# EAGLE design Athena (EAGLE 5.06)
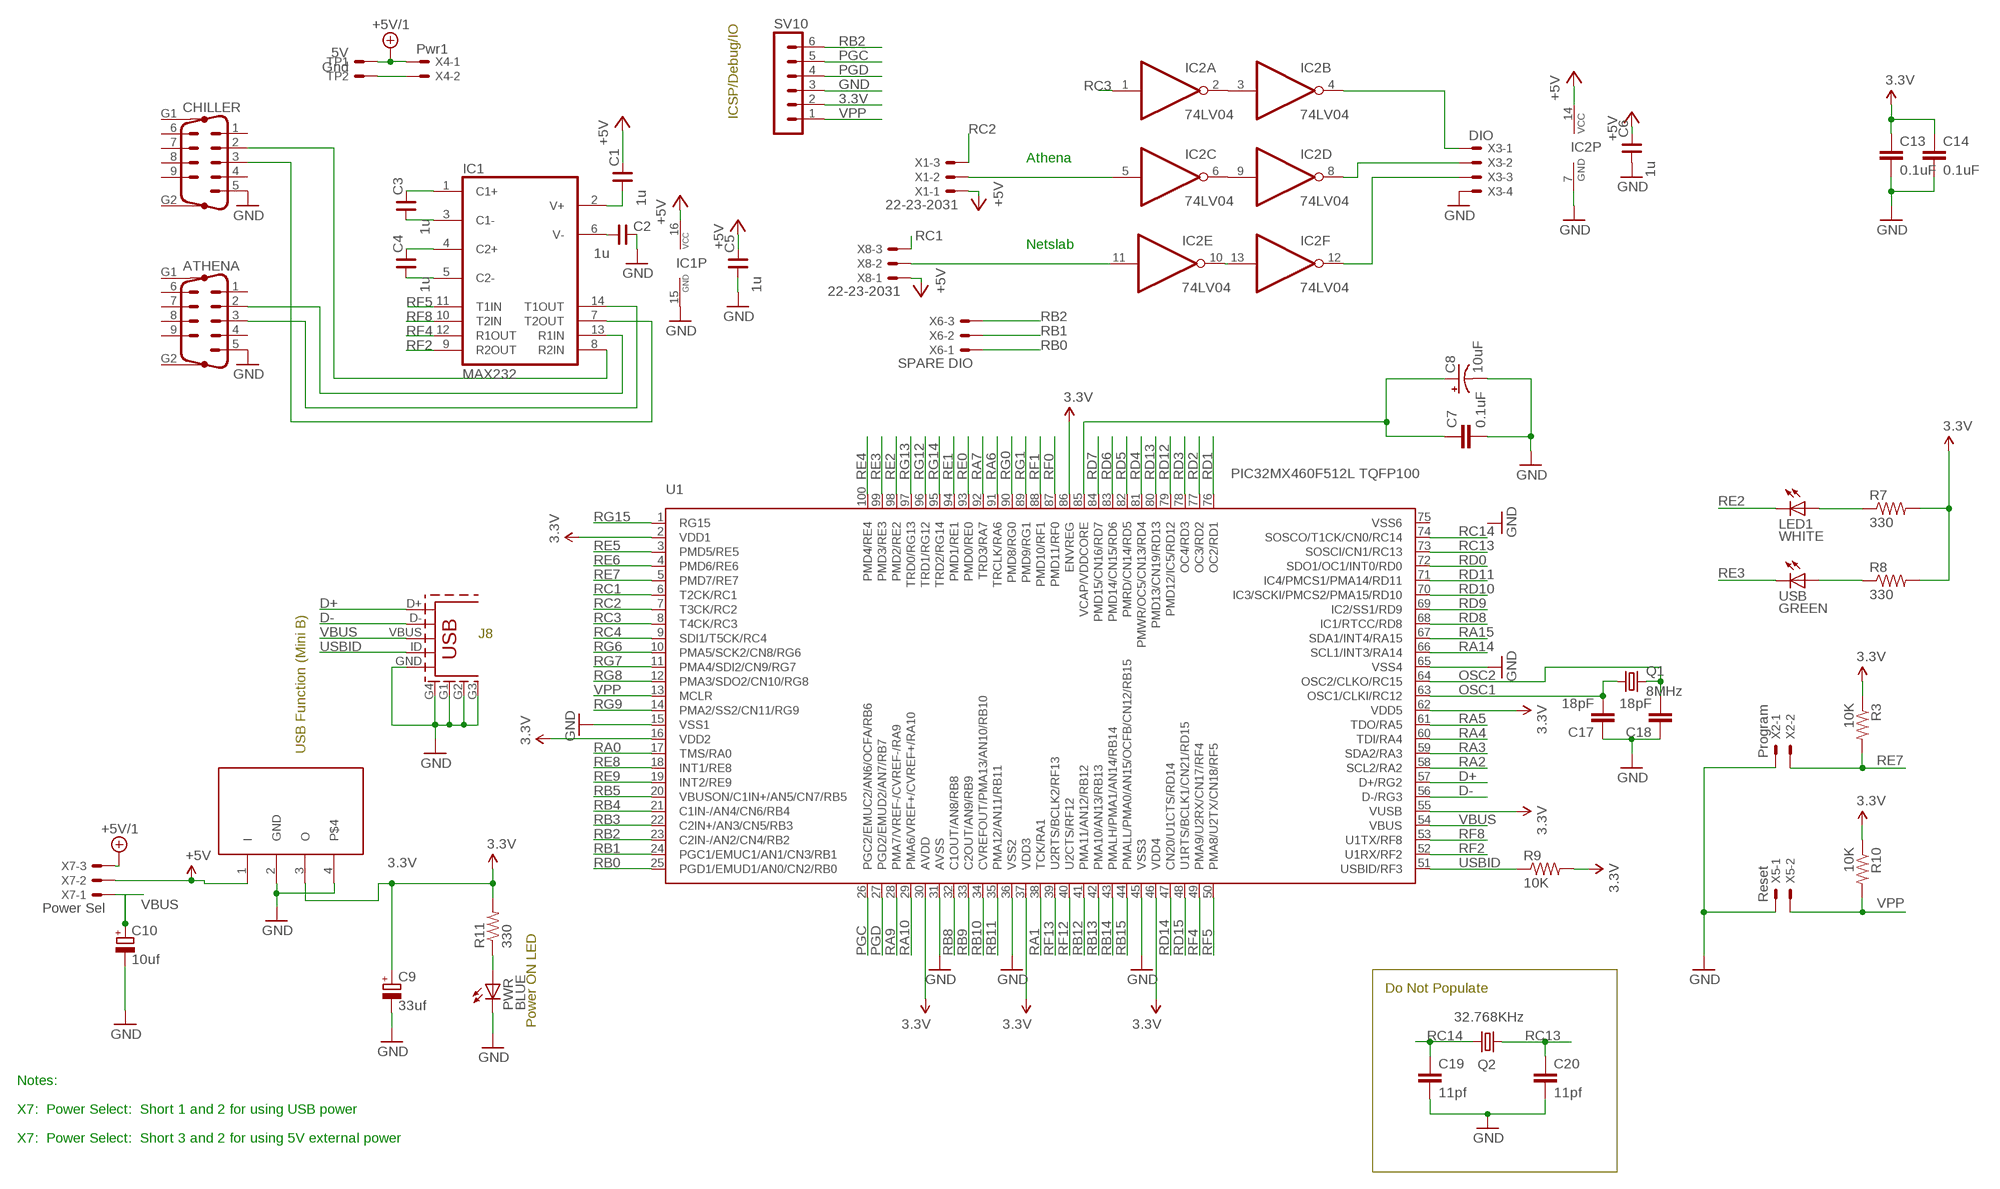
[diagram p0: schematic, sheet 1]

## Parts
ATHENA  M09HP  [M09HP]
C1  1u  CNP-C025-050X025  [C025-050X025]
C2  1u  CNP-C025-050X025  [C025-050X025]
C3  1u  CNP-C025-050X025  [C025-050X025]
C4  1u  CNP-C025-050X025  [C025-050X025]
C5  1u  CNP-C025-050X025  [C025-050X025]
C6  1u  CNP-C025-050X025  [C025-050X025]
C7  0.1uF  CAP0402-CAP  [0402-CAP]
C8  10uF  CAP_POL3528  [EIA3528]
C9  33uf  CPOL-EUE5-4  [E5-4]
C10  10uf  CPOL-EUE5-4  [E5-4]
C13  0.1uF  CAP0402  [C0402]
C14  0.1uF  CAP0402-CAP  [0402-CAP]
C17  18pF  CAP0402-CAP  [0402-CAP]
C18  18pF  CAP0402-CAP  [0402-CAP]
C19  11pf  CAP0402-CAP  [0402-CAP]
C20  11pf  CAP0402-CAP  [0402-CAP]
CHILLER  M09HP  [M09HP]
IC1  MAX232  [DIL16]
IC2  74LV04  74ACT04N  [DIL14]
LED1  WHITE  LED0603  [LED-0603]
PWR  BLUE  LED0603  [LED-0603]
Q1  8MHz  CRYSTAL5X3  [CRYSTAL-SMD-5X3]
Q2  32.768KHz  CRYSTAL32-SMD  [CRYSTAL-32KHZ-SMD]
R3  10K  RESISTOR0402-RES  [0402-RES]
R7  330  RESISTOR0402-RES  [0402-RES]
R8  330  RESISTOR0402-RES  [0402-RES]
R9  10K  RESISTOR0402-RES  [0402-RES]
R10  10K  RESISTOR0402-RES  [0402-RES]
R11  330  RESISTOR0402-RES  [0402-RES]
SV10  MA06-1  [MA06-1]
TP1  5V  TESTPOINT  [TESTPOINT]
TP2  Gnd  TESTPOINT  [TESTPOINT]
U1  PIC32MX460F512L TQFP100  PIC32MX4XXLTQFP100  [TQFP100]
U3  USB_5PINB  [USB-MINIB]
U$1  3.3VREG  [SOT223]
USB  GREEN  LED0603  [LED-0603]
X1  22-23-2031  [22-23-2031]
X2  Program  22-23-2021  [22-23-2021]
X3  DIO  22-23-2041  [22-23-2041]
X4  Pwr1  22-23-2021  [22-23-2021]
X5  Reset  22-23-2021  [22-23-2021]
X6  SPARE DIO  22-23-2031  [22-23-2031]
X7  Power Sel  22-23-2031  [22-23-2031]
X8  22-23-2031  [22-23-2031]

## Nets
3.3V: C9.+ C13.1 C14.1 R3.1 R7.2 R8.2 R9.2 R10.1 R11.2 SV10.2 U1.2(VDD1) U1.16(VDD2) U1.30(AVDD) U1.37(VDD3) U1.46(VDD4) U1.55(VUSB) U1.62(VDD5) U1.86(ENVREG) U$1.3(O)
+5V: C1.2 C5.2 C6.2 IC1.16(VCC) IC2.14(P:VCC) U$1.1(I) X1.1 X7.2 X8.1
+5V/1: TP1.TP(S) X4.1 X7.3
D+: U1.57(D+/RG2) U3.D+
D-: U1.56(D-/RG3) U3.D-
GND: ATHENA.5 C2.2 C5.1 C6.1 C7.2 C8.C(-) C9.- C10.- C13.2 C14.2 C17.1 C18.1 C19.2 C20.2 CHILLER.5 IC1.15(GND) IC2.7(P:GND) PWR.C SV10.3 TP2.TP(S) U1.15(VSS1) U1.31(AVSS) U1.36(VSS2) U1.45(VSS3) U1.65(VSS4) U3.G1 U3.G2 U3.G3 U3.G4(SHIELD) U3.GND U$1.2(GND) U$1.4 X2.1 X3.4 X4.2 X5.1
N$1: C2.1 IC1.6(V-)
N$2: C1.1 IC1.2(V+)
N$3: IC2.2(A:O) IC2.3(B:I)
N$4: IC2.6(C:O) IC2.9(D:I)
N$5: IC2.10(E:O) IC2.13(F:I)
N$6: C3.2 IC1.1(C1+)
N$7: C3.1 IC1.3(C1-)
N$8: C4.2 IC1.4(C2+)
N$9: C4.1 IC1.5(C2-)
N$10: CHILLER.2 IC1.8(R2IN)
N$11: CHILLER.3 IC1.7(T2OUT)
N$12: ATHENA.2 IC1.13(R1IN)
N$13: ATHENA.3 IC1.14(T1OUT)
N$15: IC2.11(E:I) X8.2
N$19: IC2.5(C:I) X1.2
N$21: IC2.4(B:O) X3.1
N$22: IC2.8(D:O) X3.2
N$23: IC2.12(F:O) X3.3
N$25: R8.1 USB.A
N$26: LED1.A R7.1
N$28: PWR.A R11.1
N$110: C7.1 C8.A(+) U1.85(VCAP/VDDCORE)
OSC1: C17.2 Q1.1 U1.63(OSC1/CLKI/RC12)
OSC2: C18.2 Q1.3 U1.64(OSC2/CLKO/RC15)
PGC: SV10.5 U1.26(PGC2/EMUC2/AN6/OCFA/RB6)
PGD: SV10.4 U1.27(PGD2/EMUD2/AN7/RB7)
RA0: U1.17(TMS/RA0)
RA1: U1.38(TCK/RA1)
RA2: U1.58(SCL2/RA2)
RA3: U1.59(SDA2/RA3)
RA4: U1.60(TDI/RA4)
RA5: U1.61(TDO/RA5)
RA6: U1.91(TRCLK/RA6)
RA7: U1.92(TRD3/RA7)
RA9: U1.28(PMA7/VREF-/CVREF-/RA9)
RA10: U1.29(PMA6/VREF+/CVREF+/RA10)
RA14: U1.66(SCL1/INT3/RA14)
RA15: U1.67(SDA1/INT4/RA15)
RB0: U1.25(PGD1/EMUD1/AN0/CN2/RB0) X6.1
RB1: U1.24(PGC1/EMUC1/AN1/CN3/RB1) X6.2
RB2: SV10.6 U1.23(C2IN-/AN2/CN4/RB2) X6.3
RB3: U1.22(C2IN+/AN3/CN5/RB3)
RB4: U1.21(C1IN-/AN4/CN6/RB4)
RB5: U1.20(VBUSON/C1IN+/AN5/CN7/RB5)
RB8: U1.32(C1OUT/AN8/RB8)
RB9: U1.33(C2OUT/AN9/RB9)
RB10: U1.34(CVREFOUT/PMA13/AN10/RB10)
RB11: U1.35(PMA12/AN11/RB11)
RB12: U1.41(PMA11/AN12/RB12)
RB13: U1.42(PMA10/AN13/RB13)
RB14: U1.43(PMALH/PMA1/AN14/RB14)
RB15: U1.44(PMALL/PMA0/AN15/OCFB/CN12/RB15)
RC1: U1.6(T2CK/RC1) X8.3
RC2: U1.7(T3CK/RC2) X1.3
RC3: IC2.1(A:I) U1.8(T4CK/RC3)
RC4: U1.9(SDI1/T5CK/RC4)
RC13: C20.1 Q2.X1 U1.73(SOSCI/CN1/RC13)
RC14: C19.1 Q2.X2 U1.74(SOSCO/T1CK/CN0/RC14)
RD0: U1.72(SDO1/OC1/INT0/RD0)
RD1: U1.76(OC2/RD1)
RD2: U1.77(OC3/RD2)
RD3: U1.78(OC4/RD3)
RD4: U1.81(PMWR/OC5/CN13/RD4)
RD5: U1.82(PMRD/CN14/RD5)
RD6: U1.83(PMD14/CN15/RD6)
RD7: U1.84(PMD15/CN16/RD7)
RD8: U1.68(IC1/RTCC/RD8)
RD9: U1.69(IC2/SS1/RD9)
RD10: U1.70(IC3/SCKI/PMCS2/PMA15/RD10)
RD11: U1.71(IC4/PMCS1/PMA14/RD11)
RD12: U1.79(PMD12/IC5/RD12)
RD13: U1.80(PMD13/CN19/RD13)
RD14: U1.47(CN20/U1CTS/RD14)
RD15: U1.48(U1RTS/BCLK1/CN21/RD15)
RE0: U1.93(PMD0/RE0)
RE1: U1.94(PMD1/RE1)
RE2: LED1.C U1.98(PMD2/RE2)
RE3: U1.99(PMD3/RE3) USB.C
RE4: U1.100(PMD4/RE4)
RE5: U1.3(PMD5/RE5)
RE6: U1.4(PMD6/RE6)
RE7: R3.2 U1.5(PMD7/RE7) X2.2
RE8: U1.18(INT1/RE8)
RE9: U1.19(INT2/RE9)
RF0: U1.87(PMD11/RF0)
RF1: U1.88(PMD10/RF1)
RF2: IC1.9(R2OUT) U1.52(U1RX/RF2)
RF4: IC1.12(R1OUT) U1.49(PMA9/U2RX/CN17/RF4)
RF5: IC1.11(T1IN) U1.50(PMA8/U2TX/CN18/RF5)
RF8: IC1.10(T2IN) U1.53(U1TX/RF8)
RF12: U1.40(U2CTS/RF12)
RF13: U1.39(U2RTS/BCLK2/RF13)
RG0: U1.90(PMD8/RG0)
RG1: U1.89(PMD9/RG1)
RG6: U1.10(PMA5/SCK2/CN8/RG6)
RG7: U1.11(PMA4/SDI2/CN9/RG7)
RG8: U1.12(PMA3/SDO2/CN10/RG8)
RG9: U1.14(PMA2/SS2/CN11/RG9)
RG12: U1.96(TRD1/RG12)
RG13: U1.97(TRD0/RG13)
RG14: U1.95(TRD2/RG14)
RG15: U1.1(RG15)
USBID: R9.1 U1.51(USBID/RF3) U3.ID(USB_ID)
VBUS: C10.+ U1.54(VBUS) U3.VBUS X7.1
VPP: R10.2 SV10.1 U1.13(MCLR) X5.2
Unconnected: ATHENA.1 ATHENA.4 ATHENA.6 ATHENA.7 ATHENA.8 ATHENA.9 ATHENA.G1 ATHENA.G2 CHILLER.1 CHILLER.4 CHILLER.6 CHILLER.7 CHILLER.8 CHILLER.9 CHILLER.G1 CHILLER.G2 U1.75(VSS6)

## Notes on the sheet
- ICSP/Debug/IO
- Athena
- Netslab
- J8
- USB Function (Mini B)
- Do Not Populate
- Power ON LED
- Notes:
- X7:  Power Select:  Short 1 and 2 for using USB power
- X7:  Power Select:  Short 3 and 2 for using 5V external power

## Library data of the parts
ATHENA CHILLER = con-subd:M09HP: SUB-D
C1-C6 = cap-master:CNP-: NON-POLARIZED CAP
C7 C14 C17-C20 = SparkFun:CAP: Capacitor Standard 0603 ceramic capacitor, and 0.1" leaded capacitor.
C8 = SparkFun02-20-08:CAP_POL: Capacitor Polarized These are standard SMD and PTH capacitors. Normally 10uF, 47uF, and 100uF in electrolytic and tantalum varieties. Always verify the external diameter of the through hole cap, it varies with capacity, voltage, and manufacturer. The EIA devices should be standard.
C9 C10 = resistor:CPOL-EU: POLARIZED CAPACITOR, European symbol
C13 = SparkFun02-20-08:CAP: Capacitor Standard 0603 ceramic capacitor, and 0.1" leaded capacitor.
IC1 = maxim:MAX232: RS232 TRANSEIVER
IC2 = 74xx-eu:74*04: Hex INVERTER
LED1 PWR USB = SparkFun:LED: LEDs Standard schematic elements and footprints for 5mm, 3mm, 1206, and 0603 sized LEDs. 5mm - Spark Fun Electronics SKU : COM-00529 (and others)
Q1 = SparkFun11_03_09:CRYSTAL: Crystals Various standard crystals. Proven footprints. Spark Fun Electronics SKU : COM-00534
Q2 = SchmalzHaus:CRYSTAL: Crystals Various standard crystals. Proven footprints. Spark Fun Electronics SKU : COM-00534
R3 R7-R11 = SparkFun:RESISTOR: Resistor Basic schematic elements and footprints for 0603, 1206, and PTH 1/10th watt (small) resistors.
SV10 = con-lstb:MA06-1: PIN HEADER
TP1 TP2 = OMX-MIX:TESTPOINT
U1 = SchmalzHaus:PIC32MX4XXL
U3 = OMX-MIX:USB_5PIN
U$1 = SparkFun:3.3VREG
X1 X6-X8 = con-molex:22-23-2031: .100" (2.54mm) Center Header - 3 Pin
X2 X4 X5 = con-molex:22-23-2021: .100" (2.54mm) Center Header - 2 Pin
X3 = con-molex:22-23-2041: .100" (2.54mm) Center Header - 4 Pin

## Board
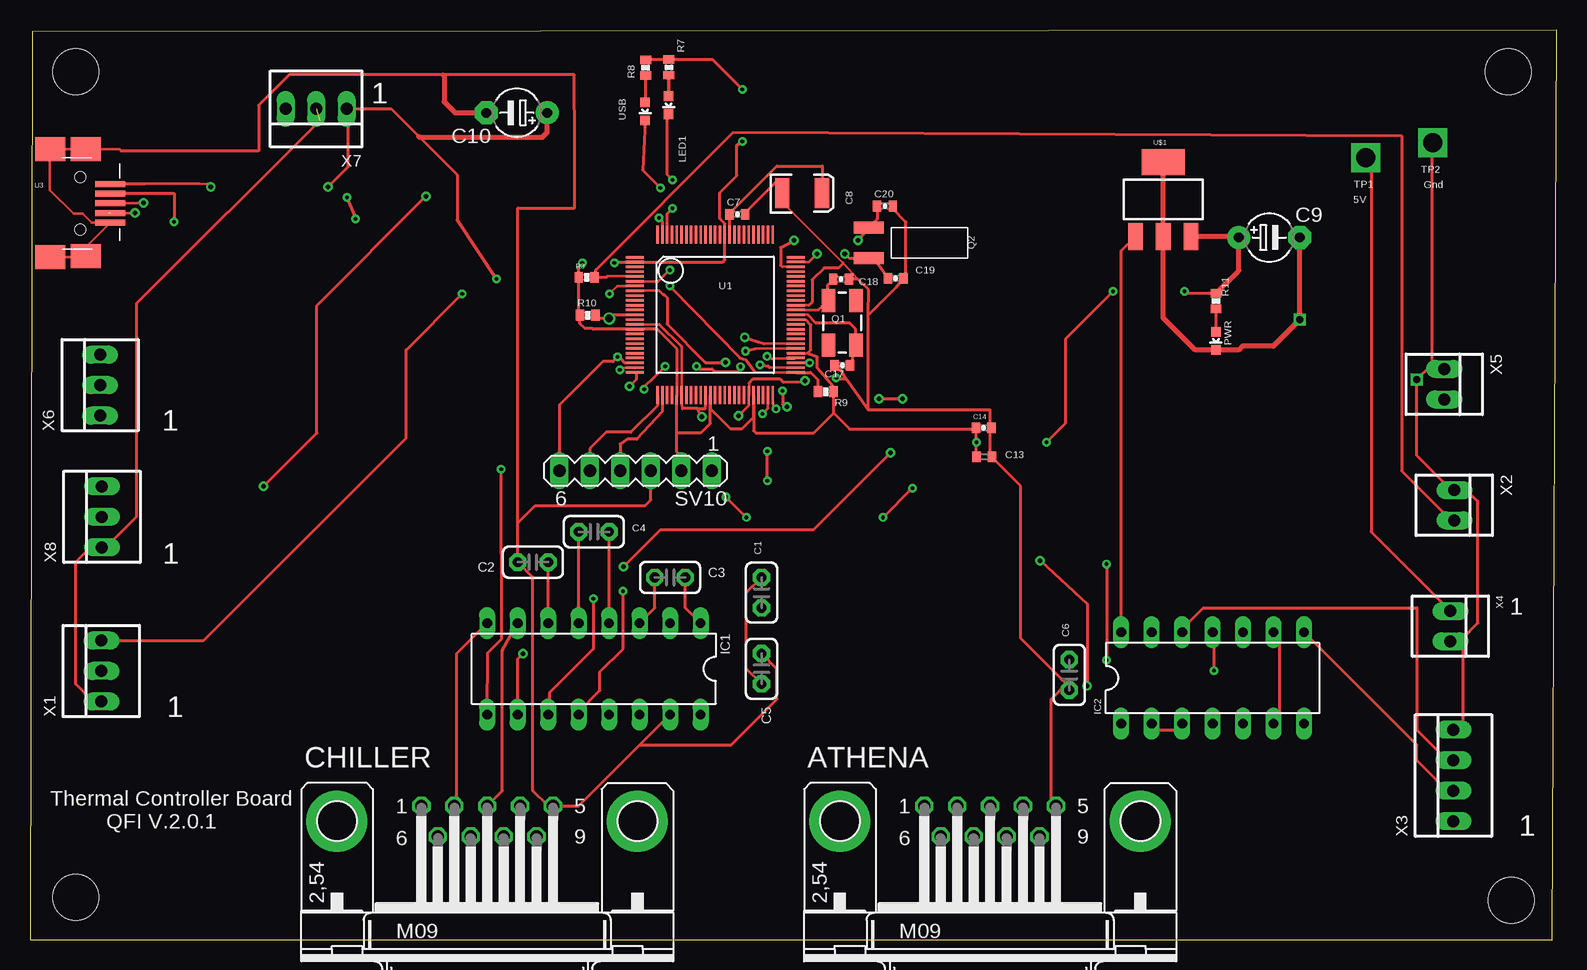
[diagram p1: board, top side]
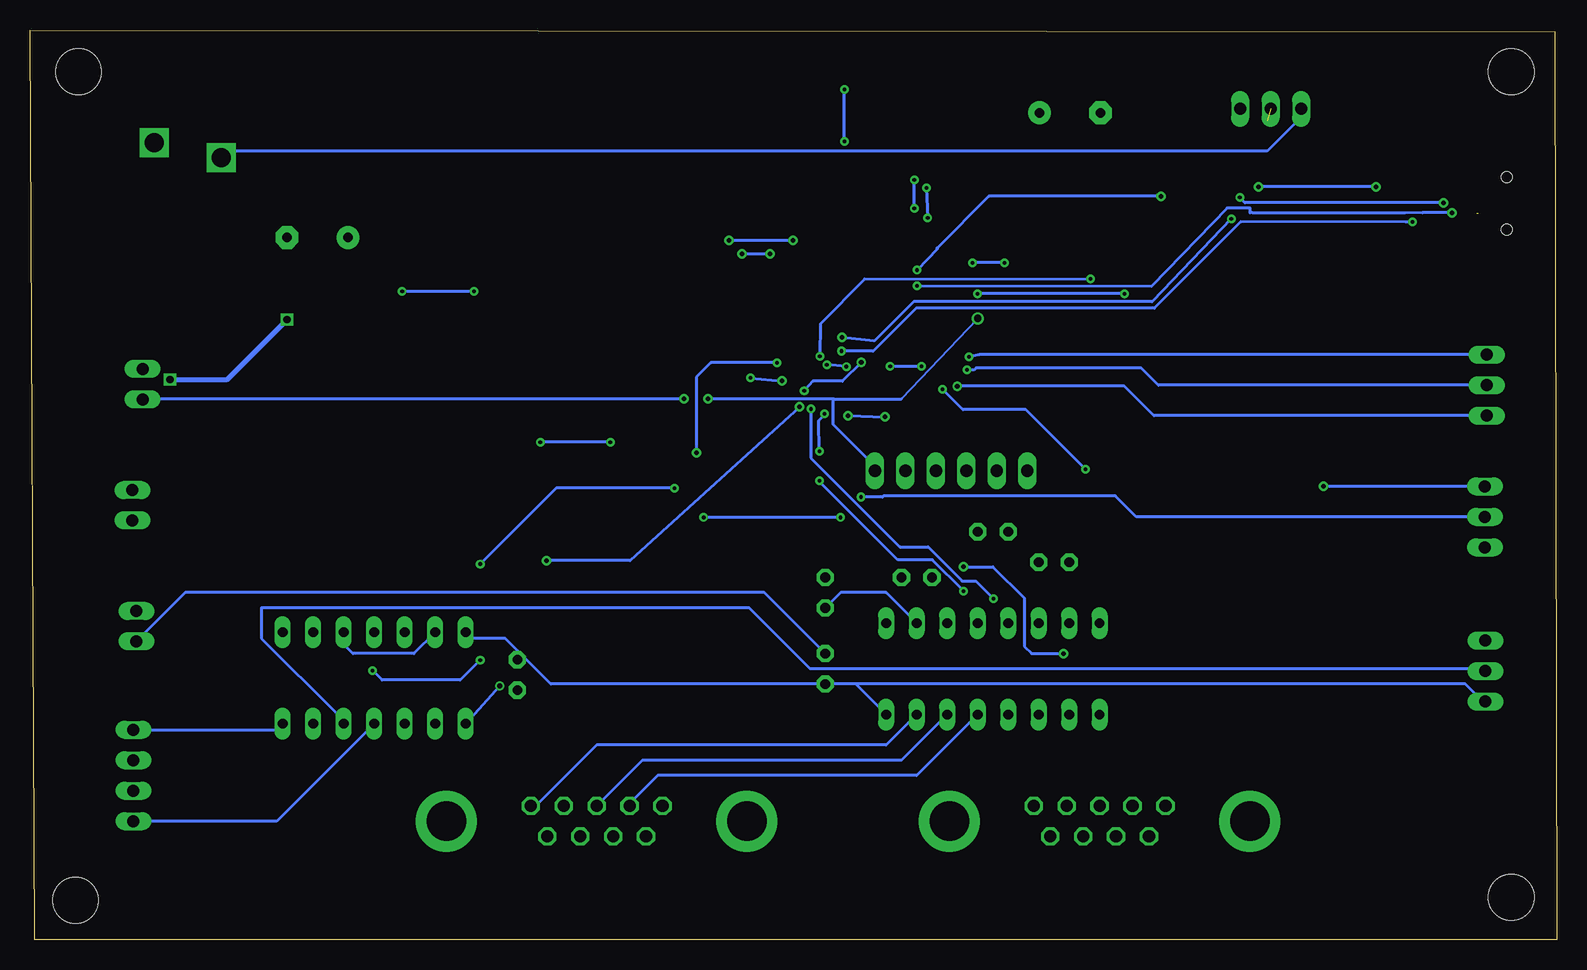
[diagram p2: board, bottom side, seen from below]

Size 127.23 x 75.87 mm. Coordinates in mm from the lower left corner, seen from the top.
Outline: 0,0 126.85,0 127.23,75.87 0.18,75.72 0,0
Copper layers (1*16): Top 0.035mm / dielectric 1.5mm / Bottom 0.035mm
Design rules "default *": minimum track width 5mil, minimum drill 10mil, track to track 5mil, track to pad 5mil, pad to pad 5mil, via to via 8mil, smd to smd 5mil, copper to edge 40mil, drill to drill 8mil, minimum pad ring 10mil, minimum via ring 8mil, stop-mask expansion 4mil, vias tented up to drill 0mil, thermal gap 10mil
Holes 3.81 mm at 3.81,72.39 3.81,3.56 123.19,72.39 123.44,3.3

### Footprints (pad centres in the part's own frame; a part is rotated, then mirrored left to right if it is on the bottom)
M09HP = drill 1.016 octagon: 1 -5.486,1.27; 2 -2.743,1.27; 3 0,1.27; 4 2.743,1.27; 5 5.486,1.27; 6 -4.115,-1.27; 7 -1.372,-1.27; 8 1.372,-1.27; 9 4.115,-1.27 | drill 3.302 pad 5.08 round: G1 -12.522,0; G2 12.522,0
C025-050X025 = drill 0.813 pad 1.422 octagon: 1 -1.27,0; 2 1.27,0
0402-CAP = smd 0.7 x 0.9: 1 -0.65,0; 2 0.65,0
EIA3528 = smd 1.2 x 2.5: A 1.65,0; C -1.65,0
E5-4 = drill 0.813 pad 1.905 round: + -2.54,0 | drill 0.813 pad 1.905 octagon: - 2.54,0
C0402 = smd 0.7 x 0.9: 1 -0.65,0; 2 0.65,0
DIL16 = drill 0.813 long: 1 -8.89,-3.81; 2 -6.35,-3.81; 3 -3.81,-3.81; 4 -1.27,-3.81; 5 1.27,-3.81; 6 3.81,-3.81; 7 6.35,-3.81; 8 8.89,-3.81; 9 8.89,3.81; 10 6.35,3.81; 11 3.81,3.81; 12 1.27,3.81; 13 -1.27,3.81; 14 -3.81,3.81; 15 -6.35,3.81; 16 -8.89,3.81
DIL14 = drill 0.813 long: 1 -7.62,-3.81; 2 -5.08,-3.81; 3 -2.54,-3.81; 4 0,-3.81; 5 2.54,-3.81; 6 5.08,-3.81; 7 7.62,-3.81; 8 7.62,3.81; 9 5.08,3.81; 10 2.54,3.81; 11 0,3.81; 12 -2.54,3.81; 13 -5.08,3.81; 14 -7.62,3.81
LED-0603 = smd 0.8 x 0.8: A 0,-0.75; C 0,0.75
CRYSTAL-SMD-5X3 = smd 1.9 x 1.1: 1 -1.85,-1.15; 2 1.85,-1.15; 3 1.85,1.15; 4 -1.85,1.15
CRYSTAL-32KHZ-SMD = smd 1 x 2.5: X1 -1.27,0; X2 1.27,0
0402-RES = smd 0.7 x 0.9: 1 -0.65,0; 2 0.65,0
MA06-1 = drill 1.016 long: 1 -6.35,0; 2 -3.81,0; 3 -1.27,0; 4 1.27,0; 5 3.81,0; 6 6.35,0
TESTPOINT = drill 1.6 square: TP 0,0
TQFP100 = smd 0.2 x 1.5: 1 -4.8,-6.7; 2 -4.4,-6.7; 3 -4,-6.7; 4 -3.6,-6.7; 5 -3.2,-6.7; 6 -2.8,-6.7; 7 -2.4,-6.7; 8 -2,-6.7; 9 -1.6,-6.7; 10 -1.2,-6.7; 11 -0.8,-6.7; 12 -0.4,-6.7; 13 0,-6.7; 14 0.4,-6.7; 15 0.8,-6.7; 16 1.2,-6.7; 17 1.6,-6.7; 18 2,-6.7; 19 2.4,-6.7; 20 2.8,-6.7; 21 3.2,-6.7; 22 3.6,-6.7; 23 4,-6.7; 24 4.4,-6.7; 25 4.8,-6.7; 51 4.8,6.7; 52 4.4,6.7; 53 4,6.7; 54 3.6,6.7; 55 3.2,6.7; 56 2.8,6.7; 57 2.4,6.7; 58 2,6.7; 59 1.6,6.7; 60 1.2,6.7; 61 0.8,6.7; 62 0.4,6.7; 63 0,6.7; 64 -0.4,6.7; 65 -0.8,6.7; 66 -1.2,6.7; 67 -1.6,6.7; 68 -2,6.7; 69 -2.4,6.7; 70 -2.8,6.7; 71 -3.2,6.7; 72 -3.6,6.7; 73 -4,6.7; 74 -4.4,6.7; 75 -4.8,6.7 | smd 1.5 x 0.2: 26 6.7,-4.8; 27 6.7,-4.4; 28 6.7,-4; 29 6.7,-3.6; 30 6.7,-3.2; 31 6.7,-2.8; 32 6.7,-2.4; 33 6.7,-2; 34 6.7,-1.6; 35 6.7,-1.2; 36 6.7,-0.8; 37 6.7,-0.4; 38 6.7,0; 39 6.7,0.4; 40 6.7,0.8; 41 6.7,1.2; 42 6.7,1.6; 43 6.7,2; 44 6.7,2.4; 45 6.7,2.8; 46 6.7,3.2; 47 6.7,3.6; 48 6.7,4; 49 6.7,4.4; 50 6.7,4.8; 76 -6.7,4.8; 77 -6.7,4.4; 78 -6.7,4; 79 -6.7,3.6; 80 -6.7,3.2; 81 -6.7,2.8; 82 -6.7,2.4; 83 -6.7,2; 84 -6.7,1.6; 85 -6.7,1.2; 86 -6.7,0.8; 87 -6.7,0.4; 88 -6.7,0; 89 -6.7,-0.4; 90 -6.7,-0.8; 91 -6.7,-1.2; 92 -6.7,-1.6; 93 -6.7,-2; 94 -6.7,-2.4; 95 -6.7,-2.8; 96 -6.7,-3.2; 97 -6.7,-3.6; 98 -6.7,-4; 99 -6.7,-4.4; 100 -6.7,-4.8
USB-MINIB = smd 2.5 x 0.5: D+ 2.5,0; D- 2.5,0.8; GND 2.5,-1.6; ID 2.5,-0.8; VBUS 2.5,1.6 | smd 2.5 x 2: G1 -2.492,4.5; G2 0.468,4.5; G3 -2.492,-4.5; G4 0.468,-4.4 | hole 0.9: 0,2.2; 0,-2.2
SOT223 = smd 1.219 x 2.235: 1 -2.311,-3.099; 2 0,-3.099; 3 2.311,-3.099 | smd 3.6 x 2.2: 4 0,3.099
22-23-2031 = drill 1 long: 1 -2.54,0; 2 0,0; 3 2.54,0
22-23-2021 = drill 1 long: 1 -1.27,0; 2 1.27,0
22-23-2041 = drill 1 long: 1 -3.81,0; 2 -1.27,0; 3 1.27,0; 4 3.81,0

### Placement (x,y rotation side)
ATHENA  80.01,9.91 0 top
C1  60.96,28.96 90 top
C2  41.91,31.5 180 top
C3  53.34,30.23 0 top
C4  46.99,34.04 0 top
C5  60.96,22.61 270 top
C6  86.61,22.1 90 top
C7  58.95,60.5 0 top
C8  64.34,62.26 0 top
C9  103.28,58.57 0 top
C10  40.56,68.96 180 top
C13  79.53,40.28 0 top
C14  79.48,42.7 0 top
C17  67.69,47.9 0 top
C18  67.59,55.09 180 top
C19  72.14,55.17 0 top
C20  71.25,61.19 0 top
CHILLER  38.1,9.91 0 top
IC1  46.99,22.61 180 top
IC2  98.55,21.84 0 top
LED1  53.21,69.6 180 top
PWR  98.83,49.96 180 top
Q1  67.69,51.46 90 top
Q2  69.88,58.12 270 top
R3  46.38,55.25 0 top
R7  53.24,72.75 90 top
R8  51.31,72.72 90 top
R9  66.32,45.72 0 top
R10  46.48,52.1 0 top
R11  98.83,53.26 90 top
SV10  50.47,39.12 180 top
TP1  111.3,65.23 0 top
TP2  116.89,66.47 0 top
U1  57.1,52.12 270 top
U3  4.19,61.42 0 top
U$1  94.44,61.75 0 top
USB  51.26,69.09 180 top
X1  5.94,22.43 90 top
X2  118.69,36.25 270 top
X3  118.62,13.72 90 top
X4  118.36,26.16 270 top
X5  117.86,46.33 270 top
X6  5.84,46.25 90 top
X7  23.85,69.29 180 top
X8  5.99,35.28 90 top

### Tracks (layer width: path | path; a pad name or v marks a point on that pad's centre or on a via)
3.3V  (via drill 0.3)
  Top 0.203: 53.9,44.3 53.9,45.39 U1.30 53.92,45.45 | 64.64,51.72 U1.62 | 64.77,48.9 63.82,48.9 U1.55
  Top 0.254: U1.2 57.71,56.52 57.9,56.71 U1.86 57.91,58.83 57.91,59.72 57.48,60.15 57.48,62.31 58.9,63.73 58.9,66.27 v59.36,66.57 | U1.2 | 53.9,45.39 | 64.64,51.72 65.07,51.28 65.07,49.2 64.77,48.9 65.61,48.59 65.61,47.7 66.89,46.16 R9.2 66.97,43.93 | 66.97,43.93 68.3,42.6 78.72,42.6 C14.1 78.83,41.55 | 78.83,41.55 78.83,40.34 C13.1 | 53.9,42.24 53.9,40.66 54.28,40.28 SV10.2 | 53.9,42.24 53.9,45.39 | 53.92,45.45 53.92,49.25 52.25,50.92 U1.16 46.92,50.92 46.86,50.98 46.25,50.98 45.82,51.41 45.82,52.09 R10.1 45.73,52.2 R3.1 45.72,56.16 v46.02,56.46 | U1.2 48.74,56.52 v48.69,56.46 | R8.2 53.21,73.37 R7.2 56.88,73.4 v59.36,70.92 | 53.9,42.24 53.95,42.29 55.93,42.29 56.7,43.06 U1.37 56.69,44.3 58.37,42.62 59.33,42.62 60.3,43.59 U1.46 60.3,42.47 60.5,42.27 65.31,42.27 66.97,43.93 | R11.2 96.38,53.91 v96.22,54.08 | v90.25,54.08 86.31,50.14 86.31,43.1 v84.71,41.5 | 78.83,41.55 v78.88,41.5
  Top 0.406: U$1.3 100.66,58.65 C9.+ 100.74,55.82 R11.2
  Bottom 0.254: v46.02,56.46 v48.69,56.46 | v59.36,66.57 v59.36,70.92 | v90.25,54.08 v96.22,54.08 | v78.88,41.5 v84.71,41.5
+5V  (1 unrouted)
  Top 0.254: C5.2 59.69,22.61 59.69,28.96 C1.2 | X1.1 5.08,20.07 3.81,21.34 3.81,31.5 5.08,32.77 X8.1 6.35,32.77 8.89,35.31 8.89,53.09 24.13,68.33 | IC2.14 90.93,57.46 U$1.1
  Bottom 0.254: 86.36,23.88 87.63,25.15 90.42,25.15 IC2.14 | 86.36,23.88 83.82,21.34 C5.2 58.42,21.34 | 86.36,23.88 C6.2 | 58.42,21.34 IC1.16 | 58.42,21.34 7.62,21.34 6.35,20.07 X1.1
+5V/1
  Top 0.254: X4.1 111.76,34.04 111.76,64.52 TP1.TP
  Bottom 0.254: X7.3 21.59,68.33 24.13,65.79 110.49,65.79 TP1.TP
D+  (via drill 0.3, 0.38)
  Top 0.203: 61.19,49.71 63.79,49.71 U1.57 | U3.D+ 7.9,61.44
  Top 0.254: 7.9,61.44 v9.45,61.47 | v26.42,61.9 v27.13,60.12 | v59.56,50.24 61.19,49.71
  Bottom 0.254: v9.45,61.47 9.55,61.49 25.98,61.49 25.98,61.47 v26.42,61.9 | v27.13,60.12 33.73,53.21 53.59,53.21 56.9,49.94 v59.56,50.24
D-  (via drill 0.3)
  Top 0.203: 60.45,49.3 63.78,49.3 U1.56 | U3.D- 6.53,62.24 | 6.53,62.24
  Top 0.254: 6.53,62.24 7.7,62.26 12.01,62.26 v12.01,59.87 | v59.61,49.1 60.45,49.3
  Bottom 0.254: 12.06,59.89 v12.01,59.87 12.6,59.87 26.33,59.88 33.53,52.68 53.39,52.68 56.97,49.1 v59.61,49.1
GND  (via drill 0.3, 0.38, 0.6)
  Top 0.203: 68.99,55.09 67.77,56.44 62.23,61.98 | 64.91,52.92 U1.65 | 54.38,44.3 54.3,44.58 U1.31 54.3,45.76 54.3,49.45 | 56.31,44.6 56.31,45.41 U1.36 | 59.9,44.56 U1.45 59.92,45.44 59.92,46.43 | 52.44,51.32 U1.15 | U3.G3 4.56,56.92 U3.G4 4.66,57.79 U3.GND 5.13,59.82 4.39,60.55 3.63,60.55 1.65,62.54 1.65,65.87 U3.G1 U3.G2 7.49,65.92 7.62,65.79
  Top 0.254: 119.38,25.15 119.38,17.53 X3.4 | 116.84,48.01 v115.57,46.74 115.57,40.39 118.11,37.85 X2.1 119.38,37.85 120.65,36.58 120.65,26.42 119.38,25.15 | 116.84,48.01 116.84,65.79 TP2.TP | 116.84,48.01 X5.1 | X4.2 119.38,25.15 | 86.36,21.34 85.09,20.07 85.09,11.18 ATHENA.5 | C7.2 59.69,60.71 62.23,63.25 C8.C 62.23,61.98 | 80.01,40.39 80.01,42.93 | 68.02,46.76 67.31,48.01 C17.1 | 69.85,44.2 68.02,46.76 | 69.85,44.2 80.01,44.2 80.01,42.93 | 80.01,42.93 C14.2 | 69.85,44.2 69.85,52.09 | 69.85,52.09 69.88,54.2 68.99,55.09 C18.1 | 86.36,21.34 82.55,25.15 82.55,37.85 80.01,40.39 | 86.36,21.34 C6.1 | 80.01,40.39 C13.2 | 50.8,16.26 45.72,11.18 CHILLER.5 43.18,11.18 41.91,12.45 41.91,30.23 C2.2 40.64,34.75 | 50.8,16.26 IC1.15 | C5.1 62.23,22.61 62.23,20.07 58.42,16.26 50.8,16.26 | 7.62,65.79 19.05,65.79 19.05,69.6 21.59,72.14 34.42,72.14 45.36,72.14 45.39,66.29 45.39,61.04 40.66,61.04 40.66,34.75 40.64,34.75 | C20.2 71.9,60.97 73,59.87 73,55.38 C19.2 72.16,54.41 69.85,52.09 | 64.91,52.92 65.18,53.19 65.18,55.04 66.17,56.03 67.36,56.03 67.77,56.44 | 55.65,44.3 54.38,44.3 | 55.65,44.3 56.26,44.3 56.31,44.6 | 59.9,44.56 v59.05,43.71 | v55.98,43.61 55.65,44.3 | 68.02,46.76 67.34,46.76 v67.18,46.86 | v64.57,46.61 64.59,46.56 63.86,46.48 63.88,46.51 62.79,46.48 62.51,46.76 60.25,46.76 59.92,46.43 | 54.3,49.45 52.44,51.32 | SV10.3 51.74,36.7 51.26,36.22 42.11,36.22 40.64,34.75
  Top 0.406: U$1.4 U$1.2 94.44,51.87 97.1,49.2 98.82,49.2 PWR.C 98.84,49.2 100.71,49.2 101.02,49.51 103.61,49.51 v105.82,51.71 C9.- | C10.- 35.43,68.96 34.52,69.88 34.52,72.03 34.42,72.14
  Bottom 0.254: IC2.7 106.68,17.53 X3.4 | IC1.15 55.88,16.26 80.01,16.26 85.09,11.18 ATHENA.5 | C5.1 66.04,28.96 114.3,28.96 X4.2 | v59.05,43.71 v55.98,43.61 | v67.18,46.86 v64.57,46.61
  Bottom 0.406: v115.57,46.74 110.8,46.74 v105.82,51.71
N$1
  Top 0.254: IC1.6 C2.1
N$2
  Bottom 0.254: IC1.2 55.88,28.96 59.69,28.96 C1.1
N$3
  Top 0.254: IC2.2 93.98,17.53 96.52,17.53 IC2.3
N$4
  Top 0.254: IC2.6 104.14,18.8 104.14,25.15 IC2.9
N$5
  Bottom 0.254: IC2.13 95.25,23.88 100.33,23.88 101.6,25.15 IC2.10
N$6
  Top 0.254: IC1.1 54.61,27.69 C3.2
N$7
  Top 0.254: IC1.3 52.07,27.69 C3.1
N$8
  Top 0.254: IC1.4 C4.2
N$9
  Top 0.254: IC1.5 C4.1
N$10
  Top 0.254: IC1.8 35.56,23.88 35.56,11.18 CHILLER.2
N$11
  Top 0.254: IC1.7 39.37,24.13 39.37,12.45 CHILLER.3
N$12
  Bottom 0.254: IC1.13 53.34,13.72 74.93,13.72 77.47,11.18 ATHENA.2
N$13
  Bottom 0.254: IC1.14 54.61,14.99 76.2,14.99 ATHENA.3
N$15  (via drill 0.3)
  Top 0.254: v57.99,36.93 v59.69,35.23 | v71.09,35.23 v73.53,37.67 | v89.71,31.34 v89.71,23.34 | v98.68,22.45 98.68,25.53 IC2.11
  Bottom 0.254: X8.2 35.03,35.28 36.78,37.03 56.11,37.03 56.21,36.93 v57.99,36.93 | v59.69,35.23 v71.09,35.23 | v73.53,37.67 83.39,37.67 v89.71,31.34 | v89.71,23.34 91.39,21.67 97.89,21.67 v98.68,22.45
N$19
  Bottom 0.254: IC2.5 101.6,18.8 107.95,25.15 107.95,27.69 67.31,27.69 62.23,22.61 6.35,22.61 X1.2
N$21
  Bottom 0.254: IC2.4 106.68,9.91 X3.1
N$22
  Top 0.254: IC2.8 115.57,16.26 115.57,14.99 118.11,12.45 X3.2
N$23
  Top 0.254: IC2.12 96.52,26.42 97.79,27.69 115.57,27.69 115.57,17.53 118.11,14.99 X3.3
N$25
  Top 0.254: R8.1 51.31,70.68 USB.A
N$26
  Top 0.305: R7.1 53.24,70.37 LED1.A
N$28
  Top 0.254: R11.1 PWR.A
N$110
  Top 0.254: C8.A 66.04,63.25 66.04,64.52 62.23,64.52 58.42,60.71 C7.1 U1.85
OSC1
  Top 0.203: U1.63 64.79,52.12
  Top 0.254: C17.2 68.58,48.01 68.58,49.28 Q1.1 68.76,49.62 68.76,50.98 68.28,51.46 65.46,51.46 64.79,52.12
OSC2
  Top 0.203: U1.64 65.68,52.52
  Top 0.254: 65.68,52.52 Q1.3 66.47,54.62 C18.2
PGC
  Top 0.254: U1.26 52.3,44.58 50.06,42.34 48.03,42.34 46.66,40.97 SV10.5
PGD
  Top 0.254: U1.27 52.7,44.06 50.57,41.76 49.76,41.76 49.17,41.35 49.17,39.14 SV10.4
RB0  (via drill 0.38)
  Top 0.203: 50.55,47.17 U1.25
  Top 0.254: v49.96,46.18 50.55,46.76 50.55,47.17
  Bottom 0.254: X6.1 33.58,43.71 36.04,46.18 v49.96,46.18
RB1  (via drill 0.3)
  Top 0.203: 49.17,47.73 50.38,47.7 U1.24
  Top 0.254: v49.15,47.52 49.25,47.62 49.3,47.62 49.17,47.73
  Bottom 0.254: X6.2 33.2,46.25 34.65,47.7 48.39,47.7 48.57,47.52 v49.15,47.52
RB2  (via drill 0.3)
  Top 0.203: 49.53,48.13 50.31,48.13 | 50.34,48.13 50.31,48.13 | 50.31,48.13 U1.23
  Top 0.254: 49.53,48.13 49.35,48.39 v48.97,48.62 48.57,48.21 47.73,48.21 44.12,44.6 SV10.6
  Bottom 0.254: X6.3 48.13,48.79 v48.97,48.62
RC1  (via drill 0.3, 0.38)
  Top 0.203: 52.3,54.89 50.43,54.89 U1.6
  Top 0.254: v19.46,37.82 23.9,42.27 23.9,52.91 v32.99,62 | v53.32,55.86 53.32,55.91 52.3,54.89
  Bottom 0.254: X8.3 v19.46,37.82 | v32.99,62 47.32,62 51.64,57.68 51.64,57.61 v53.32,55.86
RC2  (via drill 0.3)
  Top 0.203: v48.29,53.87 48.95,54.53 50.39,54.53 U1.7
  Top 0.254: X1.3 14.48,24.97 31.34,41.83 31.34,49.2 v36.02,53.87
  Bottom 0.254: v36.02,53.87 v48.29,53.87
RC3  (via drill 0.3, 0.38)
  Top 0.203: U1.8 52.46,54.12
  Top 0.254: 52.46,54.12 52.78,53.8 52.86,53.8 53.09,53.57 53.09,51.36 56.29,48.16 v57.96,48.16 | v62.71,45.8 62.71,44.65 62.89,44.48 v63.09,44.45 | v84.18,31.62 88.09,28.02 v88.09,21.18
  Bottom 0.254: v57.96,48.16 59.54,46.58 62,46.58 v62.71,45.8 | v63.09,44.45 77.22,31.62 v84.18,31.62 | v88.09,21.18 IC2.1
RC13  (via drill 0.38)
  Top 0.203: 62.7,56.12 U1.73
  Top 0.254: 62.7,56.12 62.56,56.26 62.56,57.73 v63.65,58.32 | v68.99,58.32 Q2.X1 70.6,60.11 C20.1
  Bottom 0.254: v63.65,58.32 v68.99,58.32
RC14  (via drill 0.38)
  Top 0.203: U1.74 64.9,56.52
  Top 0.254: C19.1 70.33,56.83 Q2.X2 68.28,56.84 67.94,57.18 67.92,57.18 v67.89,57.2 | 64.9,56.52 v65.58,57.2
  Bottom 0.254: v65.58,57.2 v67.89,57.2
RE2  (via drill 0.3)
  Top 0.254: U1.98 53.1,60.54 v53.54,60.98 | v53.54,63.37 53.11,63.8 53.11,68.74 LED1.C
  Bottom 0.254: v53.54,60.98 v53.54,63.37
RE3  (via drill 0.3)
  Top 0.254: USB.C 51.05,64.19 v52.53,62.71 | v52.43,60.2 52.48,60.1 52.53,60.1 52.71,59.92 52.71,58.83 U1.99
  Bottom 0.254: v52.53,62.71 v52.43,60.2
RE7
  Top 0.203: 48.13,55.35 50.37,55.35 U1.5
  Top 0.254: X2.2 118.11,35.31 114.3,39.12 114.3,67.06 58.6,67.33 47.17,55.91 R3.2 48.03,55.25 48.13,55.35
RF2  (via drill 0.3)
  Top 0.203: 61.67,47.73 63.79,47.73 U1.52
  Top 0.254: IC1.9 38.12,23.93 39.29,25.09 v39.27,39.24 | v51.18,45.9 51.18,46.15 v52.93,47.83 | v55.55,47.83 55.78,47.6 56.82,47.6 57.05,47.37 59.21,47.37 v59.21,47.8 | v60.83,47.96 61.49,47.85 61.67,47.73
  Bottom 0.254: v39.27,39.24 44.25,44.22 49.51,44.22 v51.18,45.9 | v52.93,47.83 v55.55,47.83 | v59.21,47.8 v60.83,47.96
RF4  (via drill 0.3)
  Top 0.203: 61.49,44.32 U1.49
  Top 0.254: IC1.12 45.72,19.02 47.5,20.8 47.5,22.35 49.43,24.28 v49.43,29.08 | v61.44,38.28 v61.44,40.74 | v61.04,43.87 61.49,44.32
  Bottom 0.254: v49.43,29.08 52.04,31.7 54.91,31.7 61.49,38.28 v61.44,38.28 | v61.44,40.74 61.49,43.31 61.04,43.76 v61.04,43.87
RF5  (via drill 0.3)
  Top 0.203: U1.50 61.93,44.3
  Top 0.254: 61.93,44.3 v62.15,44.27 | v46.94,28.45 46.94,24.26 43.28,20.6 43.28,18.9 IC1.11
  Bottom 0.254: v62.15,44.27 62.15,40.18 54.74,32.77 52.4,32.77 49.55,29.92 48.41,29.92 v46.94,28.45
RF8  (via drill 0.3, 0.38)
  Top 0.203: U1.53 65.02,48.12
  Top 0.254: 65.02,48.12 v64.97,48.13 | v71.7,40.62 65.28,34.19 52.53,34.19 v49.45,31.11 | v41.1,23.88 40.62,23.39 40.62,18.82 IC1.10
  Bottom 0.254: v64.97,48.13 70.5,48.12 71.7,46.91 v71.7,40.62 | v49.45,31.11 46.99,31.11 44.37,28.5 44.37,24.49 43.76,23.88 v41.1,23.88
USBID  (via drill 0.3, 0.38)  (1 unrouted)
  Top 0.254: 6.53,60.58 6.49,60.6 7.64,60.62 v8.74,60.63 | v53.32,54.53 59.18,48.51 59.64,48.39 60.43,47.35 U1.51 65.05,47.32 65.66,46.71 65.66,45.73 R9.1
  Bottom 0.203: 33.76,54.51 v53.32,54.53
  Bottom 0.254: v8.74,60.63 11.2,60.63 12.65,60.6 25.38,60.6 25.38,60.63 25.55,60.63 25.55,61.02 27.47,61.02 33.76,54.51
VBUS  (via drill 0.3, 0.38)
  Top 0.203: 61.87,48.46 63.74,48.46 U1.54 | U3.VBUS 7.59,63.04 | 9.58,63.04 14.15,63.04 14.81,63.02
  Top 0.254: v38.86,55.12 35.59,60.02 35.59,63.8 32.38,67 30.1,69.29 X7.1 26.52,69.16 26.52,64.46 v24.84,62.79 | v61.42,48.67 61.87,48.46 | 7.59,63.04 9.58,63.04 | 14.81,63.02 v15.06,62.79
  Top 0.406: C10.+ 43.1,67.33 42.7,66.93 32.46,66.93 32.38,67
  Bottom 0.203: v38.86,55.12 57.68,55.12
  Bottom 0.254: 57.68,55.12 61.37,51.36 v61.42,48.67 | v15.06,62.79 v24.84,62.79
VPP  (via drill 0.38, 0.61)
  Top 0.254: v70.74,45.14 v72.72,45.14 | R10.2 46.99,51.82 v48.26,51.82 48.57,52.12 U1.13
  Bottom 0.203: 54.61,45.11 v48.26,51.82
  Bottom 0.254: 60.22,45.11 54.61,45.11 | 60.22,45.11 70.74,45.11 v70.74,45.14 | v72.72,45.14 72.72,45.11 116.84,45.11 X5.2 | SV10.1 56.82,38.91 56.87,38.86 56.87,39.55 60.3,42.98 60.3,45.03 60.22,45.11

### Text on the board
tNames: 1 | 1 | 1 | 1 | 1 | Thermal Controller Board | QFI V.2.0.1 | 1